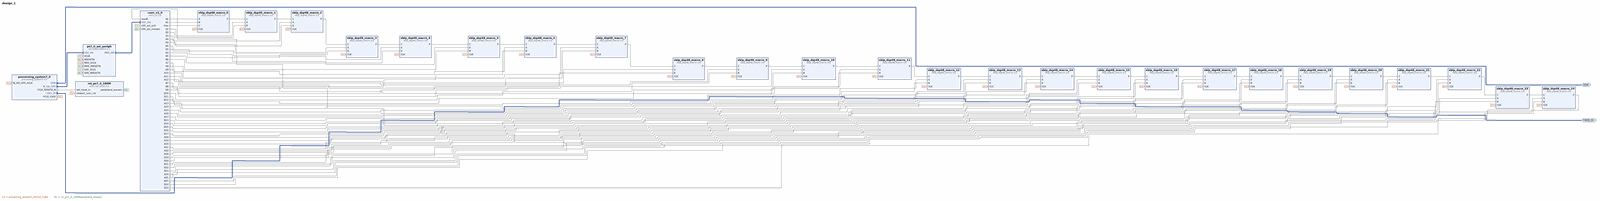
[diagram p0: block diagram of the top level, whole]
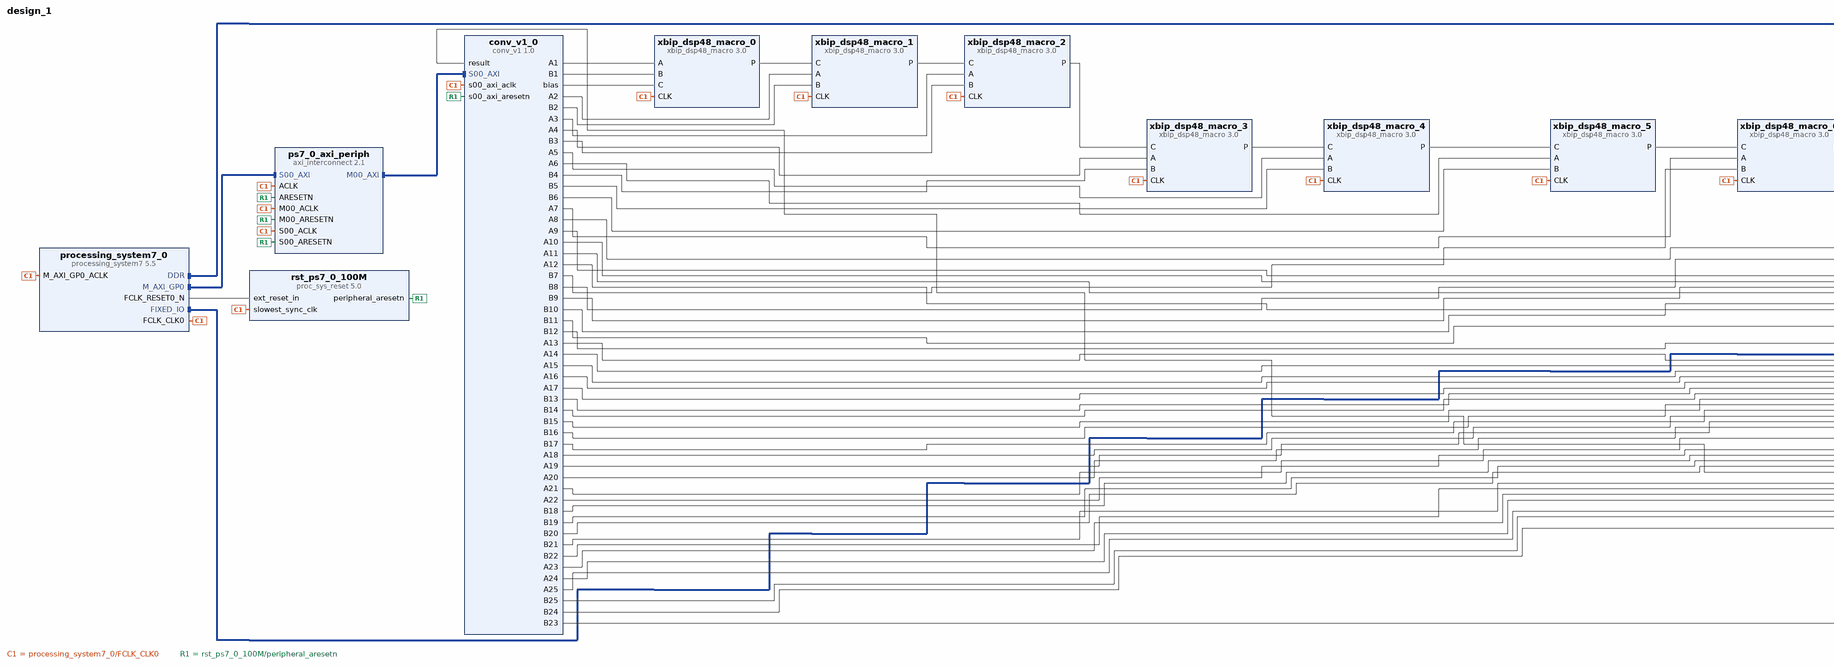
[diagram p1: block diagram of the top level, left part]
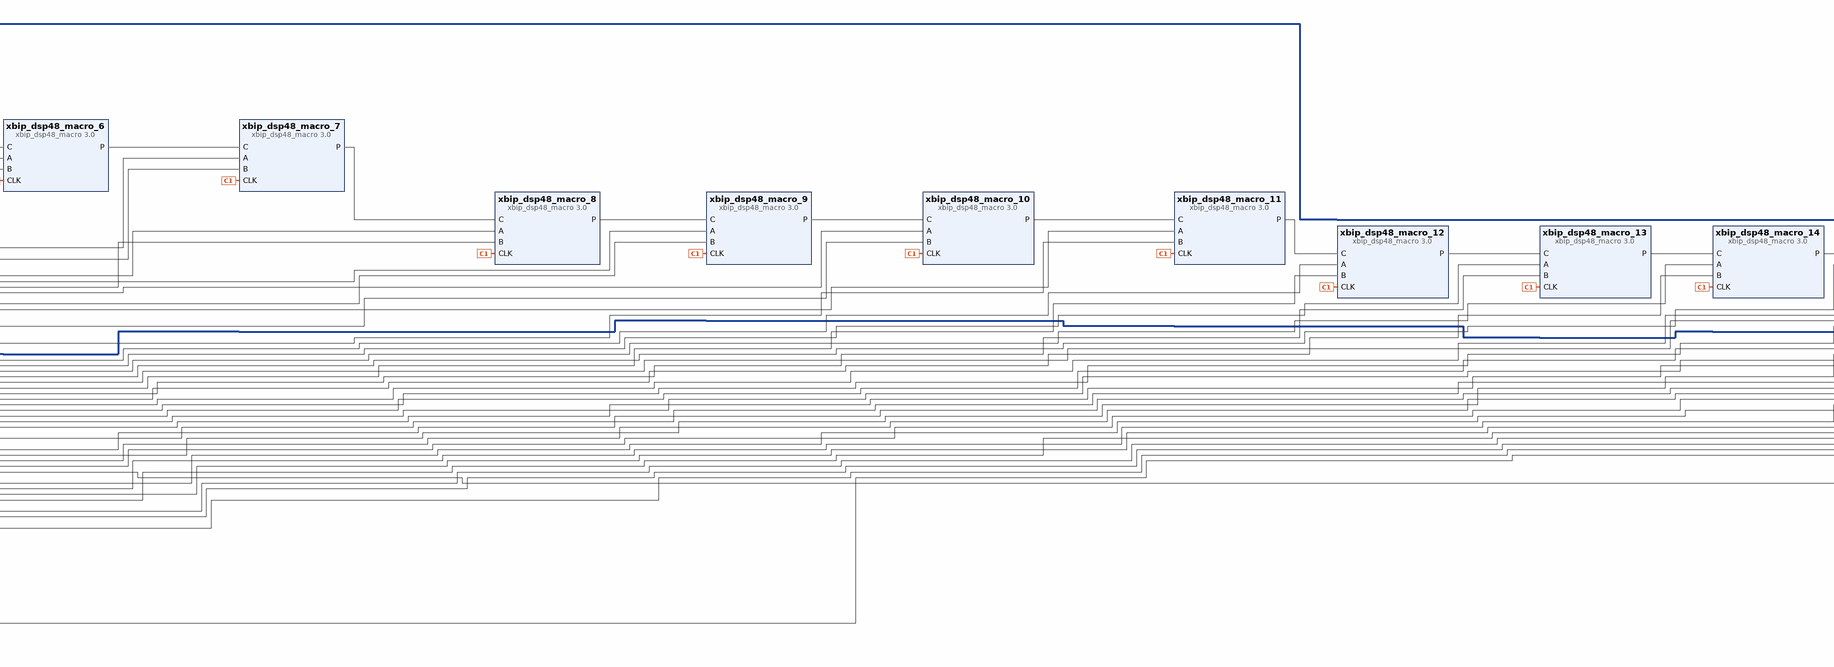
[diagram p2: block diagram of the top level, centre part]
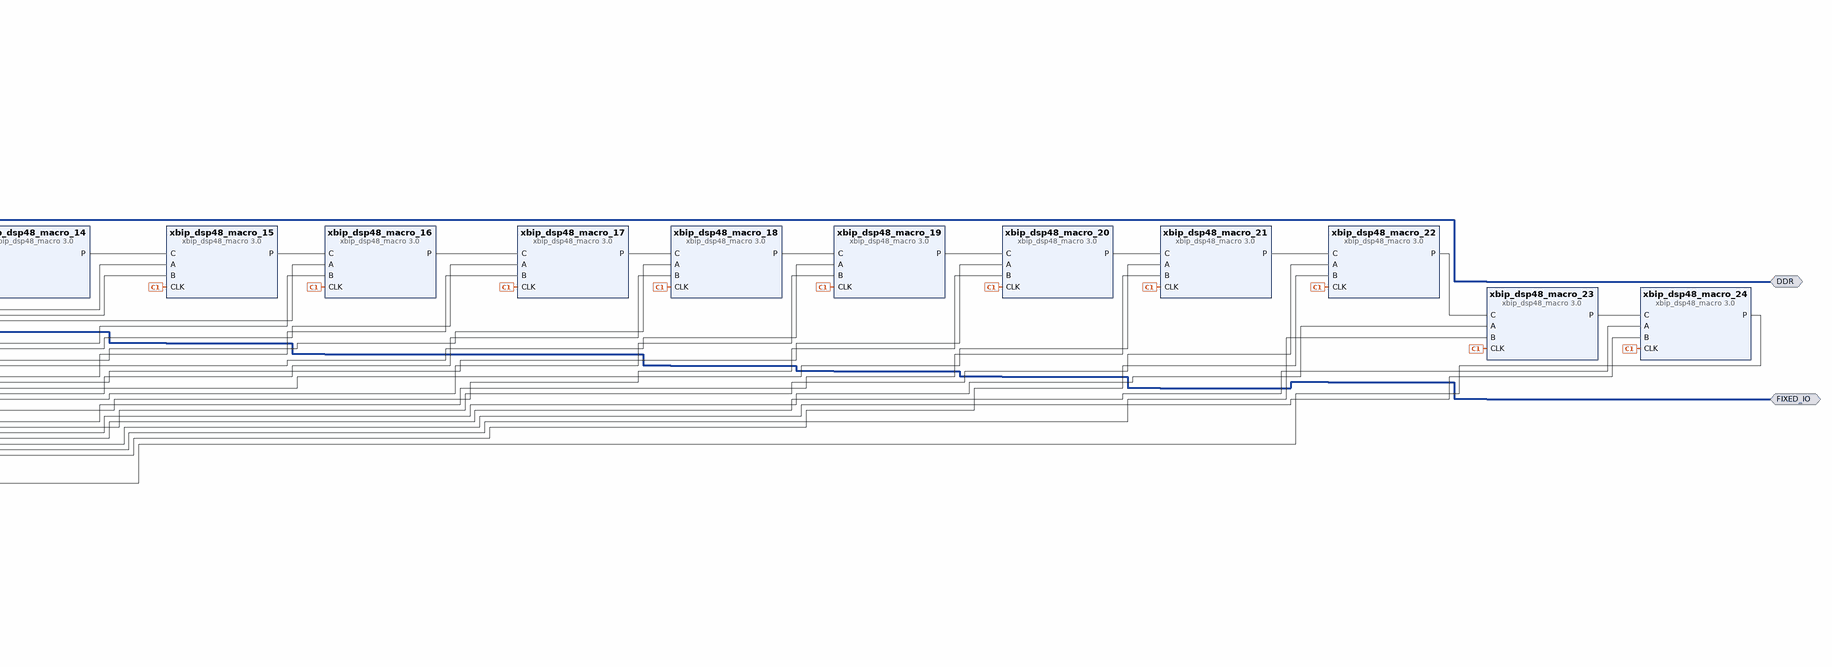
[diagram p3: block diagram of the top level, right part]
# Vivado block design design_1, xc7z020clg400-1, Vivado 2018.3
create_bd_design design_1

create_bd_intf_port -mode Master -vlnv xilinx.com:interface:ddrx_rtl:1.0 DDR
create_bd_intf_port -mode Master -vlnv xilinx.com:display_processing_system7:fixedio_rtl:1.0 FIXED_IO

create_bd_cell -type ip -vlnv xilinx.com:user:conv_v1:1.0 conv_v1_0
create_bd_cell -type ip -vlnv xilinx.com:ip:xbip_dsp48_macro:3.0 xbip_dsp48_macro_24
set_property -dict {CONFIG.a_width 25} [get_bd_cells xbip_dsp48_macro_24]
create_bd_cell -type ip -vlnv xilinx.com:ip:xbip_dsp48_macro:3.0 xbip_dsp48_macro_3
set_property -dict {CONFIG.a_width 25} [get_bd_cells xbip_dsp48_macro_3]
create_bd_cell -type ip -vlnv xilinx.com:ip:xbip_dsp48_macro:3.0 xbip_dsp48_macro_12
set_property -dict {CONFIG.a_width 25} [get_bd_cells xbip_dsp48_macro_12]
create_bd_cell -type ip -vlnv xilinx.com:ip:xbip_dsp48_macro:3.0 xbip_dsp48_macro_2
set_property -dict {CONFIG.a_width 25} [get_bd_cells xbip_dsp48_macro_2]
create_bd_cell -type ip -vlnv xilinx.com:ip:xbip_dsp48_macro:3.0 xbip_dsp48_macro_11
set_property -dict {CONFIG.a_width 25} [get_bd_cells xbip_dsp48_macro_11]
create_bd_cell -type ip -vlnv xilinx.com:ip:xbip_dsp48_macro:3.0 xbip_dsp48_macro_10
set_property -dict {CONFIG.a_width 25} [get_bd_cells xbip_dsp48_macro_10]
create_bd_cell -type ip -vlnv xilinx.com:ip:xbip_dsp48_macro:3.0 xbip_dsp48_macro_1
set_property -dict {CONFIG.a_width 25} [get_bd_cells xbip_dsp48_macro_1]
create_bd_cell -type ip -vlnv xilinx.com:ip:xbip_dsp48_macro:3.0 xbip_dsp48_macro_0
set_property -dict {CONFIG.a_width 25} [get_bd_cells xbip_dsp48_macro_0]
create_bd_cell -type ip -vlnv xilinx.com:ip:xbip_dsp48_macro:3.0 xbip_dsp48_macro_19
set_property -dict {CONFIG.a_width 25} [get_bd_cells xbip_dsp48_macro_19]
create_bd_cell -type ip -vlnv xilinx.com:ip:xbip_dsp48_macro:3.0 xbip_dsp48_macro_18
set_property -dict {CONFIG.a_width 25} [get_bd_cells xbip_dsp48_macro_18]
create_bd_cell -type ip -vlnv xilinx.com:ip:xbip_dsp48_macro:3.0 xbip_dsp48_macro_9
set_property -dict {CONFIG.a_width 25} [get_bd_cells xbip_dsp48_macro_9]
create_bd_cell -type ip -vlnv xilinx.com:ip:xbip_dsp48_macro:3.0 xbip_dsp48_macro_17
set_property -dict {CONFIG.a_width 25} [get_bd_cells xbip_dsp48_macro_17]
create_bd_cell -type ip -vlnv xilinx.com:ip:xbip_dsp48_macro:3.0 xbip_dsp48_macro_23
set_property -dict {CONFIG.a_width 25} [get_bd_cells xbip_dsp48_macro_23]
create_bd_cell -type ip -vlnv xilinx.com:ip:xbip_dsp48_macro:3.0 xbip_dsp48_macro_8
set_property -dict {CONFIG.a_width 25} [get_bd_cells xbip_dsp48_macro_8]
create_bd_cell -type ip -vlnv xilinx.com:ip:xbip_dsp48_macro:3.0 xbip_dsp48_macro_16
set_property -dict {CONFIG.a_width 25} [get_bd_cells xbip_dsp48_macro_16]
create_bd_cell -type ip -vlnv xilinx.com:ip:xbip_dsp48_macro:3.0 xbip_dsp48_macro_22
set_property -dict {CONFIG.a_width 25} [get_bd_cells xbip_dsp48_macro_22]
create_bd_cell -type ip -vlnv xilinx.com:ip:xbip_dsp48_macro:3.0 xbip_dsp48_macro_7
set_property -dict {CONFIG.a_width 25} [get_bd_cells xbip_dsp48_macro_7]
create_bd_cell -type ip -vlnv xilinx.com:ip:xbip_dsp48_macro:3.0 xbip_dsp48_macro_15
set_property -dict {CONFIG.a_width 25} [get_bd_cells xbip_dsp48_macro_15]
create_bd_cell -type ip -vlnv xilinx.com:ip:xbip_dsp48_macro:3.0 xbip_dsp48_macro_21
set_property -dict {CONFIG.a_width 25} [get_bd_cells xbip_dsp48_macro_21]
create_bd_cell -type ip -vlnv xilinx.com:ip:xbip_dsp48_macro:3.0 xbip_dsp48_macro_6
set_property -dict {CONFIG.a_width 25} [get_bd_cells xbip_dsp48_macro_6]
create_bd_cell -type ip -vlnv xilinx.com:ip:xbip_dsp48_macro:3.0 xbip_dsp48_macro_5
set_property -dict {CONFIG.a_width 25} [get_bd_cells xbip_dsp48_macro_5]
create_bd_cell -type ip -vlnv xilinx.com:ip:xbip_dsp48_macro:3.0 xbip_dsp48_macro_14
set_property -dict {CONFIG.a_width 25} [get_bd_cells xbip_dsp48_macro_14]
create_bd_cell -type ip -vlnv xilinx.com:ip:xbip_dsp48_macro:3.0 xbip_dsp48_macro_20
set_property -dict {CONFIG.a_width 25} [get_bd_cells xbip_dsp48_macro_20]
create_bd_cell -type ip -vlnv xilinx.com:ip:xbip_dsp48_macro:3.0 xbip_dsp48_macro_4
set_property -dict {CONFIG.a_width 25} [get_bd_cells xbip_dsp48_macro_4]
create_bd_cell -type ip -vlnv xilinx.com:ip:xbip_dsp48_macro:3.0 xbip_dsp48_macro_13
set_property -dict {CONFIG.a_width 25} [get_bd_cells xbip_dsp48_macro_13]
create_bd_cell -type ip -vlnv xilinx.com:ip:processing_system7:5.5 processing_system7_0
set_property -dict [list \
  CONFIG.PCW_APU_PERIPHERAL_FREQMHZ 650 \
  CONFIG.PCW_CRYSTAL_PERIPHERAL_FREQMHZ 50 \
  CONFIG.PCW_ENET0_ENET0_IO {MIO 16 .. 27} \
  CONFIG.PCW_ENET0_GRP_MDIO_ENABLE 1 \
  CONFIG.PCW_ENET0_GRP_MDIO_IO {MIO 52 .. 53} \
  CONFIG.PCW_ENET0_PERIPHERAL_ENABLE 1 \
  CONFIG.PCW_ENET0_RESET_ENABLE 1 \
  CONFIG.PCW_ENET0_RESET_IO {MIO 9} \
  CONFIG.PCW_ENET_RESET_ENABLE 1 \
  CONFIG.PCW_ENET_RESET_SELECT {Share reset pin} \
  CONFIG.PCW_FPGA0_PERIPHERAL_FREQMHZ 100 \
  CONFIG.PCW_FPGA1_PERIPHERAL_FREQMHZ 50 \
  CONFIG.PCW_GPIO_MIO_GPIO_ENABLE 1 \
  CONFIG.PCW_GPIO_MIO_GPIO_IO MIO \
  CONFIG.PCW_I2C_RESET_ENABLE 1 \
  CONFIG.PCW_M_AXI_GP0_FREQMHZ 10 \
  CONFIG.PCW_PERIPHERAL_BOARD_PRESET None \
  CONFIG.PCW_PRESET_BANK1_VOLTAGE {LVCMOS 1.8V} \
  CONFIG.PCW_QSPI_GRP_FBCLK_ENABLE 1 \
  CONFIG.PCW_QSPI_GRP_FBCLK_IO {MIO 8} \
  CONFIG.PCW_QSPI_GRP_SINGLE_SS_ENABLE 1 \
  CONFIG.PCW_QSPI_GRP_SINGLE_SS_IO {MIO 1 .. 6} \
  CONFIG.PCW_QSPI_PERIPHERAL_ENABLE 1 \
  CONFIG.PCW_QSPI_QSPI_IO {MIO 1 .. 6} \
  CONFIG.PCW_SD0_GRP_CD_ENABLE 1 \
  CONFIG.PCW_SD0_GRP_CD_IO {MIO 47} \
  CONFIG.PCW_SD0_GRP_WP_ENABLE 0 \
  CONFIG.PCW_SD0_PERIPHERAL_ENABLE 1 \
  CONFIG.PCW_SD0_SD0_IO {MIO 40 .. 45} \
  CONFIG.PCW_SDIO_PERIPHERAL_FREQMHZ 50 \
  CONFIG.PCW_SINGLE_QSPI_DATA_MODE x4 \
  CONFIG.PCW_UART0_PERIPHERAL_ENABLE 1 \
  CONFIG.PCW_UART0_UART0_IO {MIO 14 .. 15} \
  CONFIG.PCW_UART1_PERIPHERAL_ENABLE 0 \
  CONFIG.PCW_UART_PERIPHERAL_FREQMHZ 100 \
  CONFIG.PCW_UIPARAM_DDR_BUS_WIDTH {16 Bit} \
  CONFIG.PCW_UIPARAM_DDR_FREQ_MHZ 525 \
  CONFIG.PCW_UIPARAM_DDR_PARTNO {MT41J256M16 RE-125} \
  CONFIG.PCW_USB0_PERIPHERAL_ENABLE 1 \
  CONFIG.PCW_USB0_RESET_ENABLE 1 \
  CONFIG.PCW_USB0_RESET_IO {MIO 46} \
  CONFIG.PCW_USB0_USB0_IO {MIO 28 .. 39} \
  CONFIG.PCW_USB_RESET_ENABLE 1 \
  CONFIG.PCW_USB_RESET_SELECT {Share reset pin} \
] [get_bd_cells processing_system7_0]
# 481 more settings of processing_system7_0 are not shown: defaults, MIO pin electricals, DDR timing, and values the tool derives
create_bd_cell -type ip -vlnv xilinx.com:ip:axi_interconnect:2.1 ps7_0_axi_periph
set_property -dict {CONFIG.NUM_MI 1} [get_bd_cells ps7_0_axi_periph]
create_bd_cell -type ip -vlnv xilinx.com:ip:proc_sys_reset:5.0 rst_ps7_0_100M

# ---- connections ----

connect_bd_intf_net [get_bd_intf_pins ps7_0_axi_periph/M00_AXI] [get_bd_intf_pins conv_v1_0/S00_AXI]
connect_bd_intf_net [get_bd_intf_pins processing_system7_0/M_AXI_GP0] [get_bd_intf_pins ps7_0_axi_periph/S00_AXI]
connect_bd_intf_net [get_bd_intf_ports DDR] [get_bd_intf_pins processing_system7_0/DDR]
connect_bd_intf_net [get_bd_intf_ports FIXED_IO] [get_bd_intf_pins processing_system7_0/FIXED_IO]
connect_bd_net [get_bd_pins conv_v1_0/A3] [get_bd_pins xbip_dsp48_macro_2/A]
connect_bd_net [get_bd_pins conv_v1_0/A2] [get_bd_pins xbip_dsp48_macro_1/A]
connect_bd_net [get_bd_pins conv_v1_0/A1] [get_bd_pins xbip_dsp48_macro_0/A]
connect_bd_net [get_bd_pins conv_v1_0/B1] [get_bd_pins xbip_dsp48_macro_0/B]
connect_bd_net [get_bd_pins conv_v1_0/A4] [get_bd_pins xbip_dsp48_macro_3/A]
connect_bd_net [get_bd_pins conv_v1_0/A5] [get_bd_pins xbip_dsp48_macro_4/A]
connect_bd_net [get_bd_pins conv_v1_0/A6] [get_bd_pins xbip_dsp48_macro_5/A]
connect_bd_net [get_bd_pins conv_v1_0/B2] [get_bd_pins xbip_dsp48_macro_1/B]
connect_bd_net [get_bd_pins conv_v1_0/B3] [get_bd_pins xbip_dsp48_macro_2/B]
connect_bd_net [get_bd_pins conv_v1_0/B4] [get_bd_pins xbip_dsp48_macro_3/B]
connect_bd_net [get_bd_pins conv_v1_0/B5] [get_bd_pins xbip_dsp48_macro_4/B]
connect_bd_net [get_bd_pins conv_v1_0/B6] [get_bd_pins xbip_dsp48_macro_5/B]
connect_bd_net [get_bd_pins conv_v1_0/A7] [get_bd_pins xbip_dsp48_macro_6/A]
connect_bd_net [get_bd_pins conv_v1_0/A8] [get_bd_pins xbip_dsp48_macro_7/A]
connect_bd_net [get_bd_pins conv_v1_0/A9] [get_bd_pins xbip_dsp48_macro_8/A]
connect_bd_net [get_bd_pins conv_v1_0/A10] [get_bd_pins xbip_dsp48_macro_9/A]
connect_bd_net [get_bd_pins conv_v1_0/A11] [get_bd_pins xbip_dsp48_macro_10/A]
connect_bd_net [get_bd_pins conv_v1_0/A12] [get_bd_pins xbip_dsp48_macro_11/A]
connect_bd_net [get_bd_pins conv_v1_0/B7] [get_bd_pins xbip_dsp48_macro_6/B]
connect_bd_net [get_bd_pins conv_v1_0/B8] [get_bd_pins xbip_dsp48_macro_7/B]
connect_bd_net [get_bd_pins conv_v1_0/B9] [get_bd_pins xbip_dsp48_macro_8/B]
connect_bd_net [get_bd_pins conv_v1_0/B10] [get_bd_pins xbip_dsp48_macro_9/B]
connect_bd_net [get_bd_pins conv_v1_0/B11] [get_bd_pins xbip_dsp48_macro_10/B]
connect_bd_net [get_bd_pins conv_v1_0/B12] [get_bd_pins xbip_dsp48_macro_11/B]
connect_bd_net [get_bd_pins xbip_dsp48_macro_6/P] [get_bd_pins xbip_dsp48_macro_7/C]
connect_bd_net [get_bd_pins xbip_dsp48_macro_7/P] [get_bd_pins xbip_dsp48_macro_8/C]
connect_bd_net [get_bd_pins xbip_dsp48_macro_8/P] [get_bd_pins xbip_dsp48_macro_9/C]
connect_bd_net [get_bd_pins xbip_dsp48_macro_9/P] [get_bd_pins xbip_dsp48_macro_10/C]
connect_bd_net [get_bd_pins xbip_dsp48_macro_10/P] [get_bd_pins xbip_dsp48_macro_11/C]
connect_bd_net [get_bd_pins xbip_dsp48_macro_0/P] [get_bd_pins xbip_dsp48_macro_1/C]
connect_bd_net [get_bd_pins xbip_dsp48_macro_1/P] [get_bd_pins xbip_dsp48_macro_2/C]
connect_bd_net [get_bd_pins xbip_dsp48_macro_2/P] [get_bd_pins xbip_dsp48_macro_3/C]
connect_bd_net [get_bd_pins xbip_dsp48_macro_3/P] [get_bd_pins xbip_dsp48_macro_4/C]
connect_bd_net [get_bd_pins xbip_dsp48_macro_4/P] [get_bd_pins xbip_dsp48_macro_5/C]
connect_bd_net [get_bd_pins xbip_dsp48_macro_5/P] [get_bd_pins xbip_dsp48_macro_6/C]
connect_bd_net [get_bd_pins conv_v1_0/A13] [get_bd_pins xbip_dsp48_macro_12/A]
connect_bd_net [get_bd_pins conv_v1_0/A14] [get_bd_pins xbip_dsp48_macro_13/A]
connect_bd_net [get_bd_pins conv_v1_0/A15] [get_bd_pins xbip_dsp48_macro_14/A]
connect_bd_net [get_bd_pins conv_v1_0/A16] [get_bd_pins xbip_dsp48_macro_15/A]
connect_bd_net [get_bd_pins conv_v1_0/A17] [get_bd_pins xbip_dsp48_macro_16/A]
connect_bd_net [get_bd_pins conv_v1_0/B13] [get_bd_pins xbip_dsp48_macro_12/B]
connect_bd_net [get_bd_pins conv_v1_0/B14] [get_bd_pins xbip_dsp48_macro_13/B]
connect_bd_net [get_bd_pins conv_v1_0/B15] [get_bd_pins xbip_dsp48_macro_14/B]
connect_bd_net [get_bd_pins conv_v1_0/B16] [get_bd_pins xbip_dsp48_macro_15/B]
connect_bd_net [get_bd_pins conv_v1_0/B17] [get_bd_pins xbip_dsp48_macro_16/B]
connect_bd_net [get_bd_pins xbip_dsp48_macro_12/P] [get_bd_pins xbip_dsp48_macro_13/C]
connect_bd_net [get_bd_pins xbip_dsp48_macro_13/P] [get_bd_pins xbip_dsp48_macro_14/C]
connect_bd_net [get_bd_pins xbip_dsp48_macro_14/P] [get_bd_pins xbip_dsp48_macro_15/C]
connect_bd_net [get_bd_pins xbip_dsp48_macro_15/P] [get_bd_pins xbip_dsp48_macro_16/C]
connect_bd_net [get_bd_pins xbip_dsp48_macro_11/P] [get_bd_pins xbip_dsp48_macro_12/C]
connect_bd_net [get_bd_pins conv_v1_0/A18] [get_bd_pins xbip_dsp48_macro_17/A]
connect_bd_net [get_bd_pins conv_v1_0/A19] [get_bd_pins xbip_dsp48_macro_18/A]
connect_bd_net [get_bd_pins conv_v1_0/A20] [get_bd_pins xbip_dsp48_macro_19/A]
connect_bd_net [get_bd_pins conv_v1_0/A21] [get_bd_pins xbip_dsp48_macro_20/A]
connect_bd_net [get_bd_pins conv_v1_0/A22] [get_bd_pins xbip_dsp48_macro_21/A]
connect_bd_net [get_bd_pins conv_v1_0/B18] [get_bd_pins xbip_dsp48_macro_17/B]
connect_bd_net [get_bd_pins conv_v1_0/B19] [get_bd_pins xbip_dsp48_macro_18/B]
connect_bd_net [get_bd_pins conv_v1_0/B20] [get_bd_pins xbip_dsp48_macro_19/B]
connect_bd_net [get_bd_pins conv_v1_0/B21] [get_bd_pins xbip_dsp48_macro_20/B]
connect_bd_net [get_bd_pins conv_v1_0/B22] [get_bd_pins xbip_dsp48_macro_21/B]
connect_bd_net [get_bd_pins xbip_dsp48_macro_20/P] [get_bd_pins xbip_dsp48_macro_21/C]
connect_bd_net [get_bd_pins xbip_dsp48_macro_19/P] [get_bd_pins xbip_dsp48_macro_20/C]
connect_bd_net [get_bd_pins xbip_dsp48_macro_18/P] [get_bd_pins xbip_dsp48_macro_19/C]
connect_bd_net [get_bd_pins xbip_dsp48_macro_17/P] [get_bd_pins xbip_dsp48_macro_18/C]
connect_bd_net [get_bd_pins xbip_dsp48_macro_16/P] [get_bd_pins xbip_dsp48_macro_17/C]
connect_bd_net [get_bd_pins conv_v1_0/A23] [get_bd_pins xbip_dsp48_macro_22/A]
connect_bd_net [get_bd_pins conv_v1_0/A24] [get_bd_pins xbip_dsp48_macro_23/A]
connect_bd_net [get_bd_pins conv_v1_0/A25] [get_bd_pins xbip_dsp48_macro_24/A]
connect_bd_net [get_bd_pins conv_v1_0/B25] [get_bd_pins xbip_dsp48_macro_24/B]
connect_bd_net [get_bd_pins conv_v1_0/B24] [get_bd_pins xbip_dsp48_macro_23/B]
connect_bd_net [get_bd_pins conv_v1_0/B23] [get_bd_pins xbip_dsp48_macro_22/B]
connect_bd_net [get_bd_pins xbip_dsp48_macro_22/P] [get_bd_pins xbip_dsp48_macro_23/C]
connect_bd_net [get_bd_pins xbip_dsp48_macro_23/P] [get_bd_pins xbip_dsp48_macro_24/C]
connect_bd_net [get_bd_pins xbip_dsp48_macro_21/P] [get_bd_pins xbip_dsp48_macro_22/C]
connect_bd_net [get_bd_pins conv_v1_0/bias] [get_bd_pins xbip_dsp48_macro_0/C]
connect_bd_net [get_bd_pins xbip_dsp48_macro_24/P] [get_bd_pins conv_v1_0/result]
connect_bd_net [get_bd_pins processing_system7_0/FCLK_CLK0] \
  [get_bd_pins processing_system7_0/M_AXI_GP0_ACLK] [get_bd_pins ps7_0_axi_periph/S00_ACLK] \
  [get_bd_pins rst_ps7_0_100M/slowest_sync_clk] [get_bd_pins conv_v1_0/s00_axi_aclk] [get_bd_pins ps7_0_axi_periph/M00_ACLK] \
  [get_bd_pins ps7_0_axi_periph/ACLK] [get_bd_pins xbip_dsp48_macro_24/CLK] [get_bd_pins xbip_dsp48_macro_3/CLK] \
  [get_bd_pins xbip_dsp48_macro_12/CLK] [get_bd_pins xbip_dsp48_macro_2/CLK] [get_bd_pins xbip_dsp48_macro_11/CLK] \
  [get_bd_pins xbip_dsp48_macro_10/CLK] [get_bd_pins xbip_dsp48_macro_1/CLK] [get_bd_pins xbip_dsp48_macro_0/CLK] \
  [get_bd_pins xbip_dsp48_macro_19/CLK] [get_bd_pins xbip_dsp48_macro_18/CLK] [get_bd_pins xbip_dsp48_macro_9/CLK] \
  [get_bd_pins xbip_dsp48_macro_17/CLK] [get_bd_pins xbip_dsp48_macro_23/CLK] [get_bd_pins xbip_dsp48_macro_8/CLK] \
  [get_bd_pins xbip_dsp48_macro_16/CLK] [get_bd_pins xbip_dsp48_macro_22/CLK] [get_bd_pins xbip_dsp48_macro_7/CLK] \
  [get_bd_pins xbip_dsp48_macro_15/CLK] [get_bd_pins xbip_dsp48_macro_21/CLK] [get_bd_pins xbip_dsp48_macro_6/CLK] \
  [get_bd_pins xbip_dsp48_macro_5/CLK] [get_bd_pins xbip_dsp48_macro_14/CLK] [get_bd_pins xbip_dsp48_macro_20/CLK] \
  [get_bd_pins xbip_dsp48_macro_4/CLK] [get_bd_pins xbip_dsp48_macro_13/CLK]
connect_bd_net [get_bd_pins processing_system7_0/FCLK_RESET0_N] [get_bd_pins rst_ps7_0_100M/ext_reset_in]
connect_bd_net [get_bd_pins rst_ps7_0_100M/peripheral_aresetn] \
  [get_bd_pins ps7_0_axi_periph/S00_ARESETN] [get_bd_pins conv_v1_0/s00_axi_aresetn] \
  [get_bd_pins ps7_0_axi_periph/M00_ARESETN] [get_bd_pins ps7_0_axi_periph/ARESETN]

# ---- address map ----
assign_bd_address -offset 0x43C00000 -range 64K -target_address_space [get_bd_addr_spaces processing_system7_0/Data] [get_bd_addr_segs conv_v1_0/S00_AXI/S00_AXI_reg]

validate_bd_design
save_bd_design
